# Altium schematic sheet DMX_RP2040.SchDoc: DMX / RP2040
size B; SheetNumber: 8; SheetTotal: 14
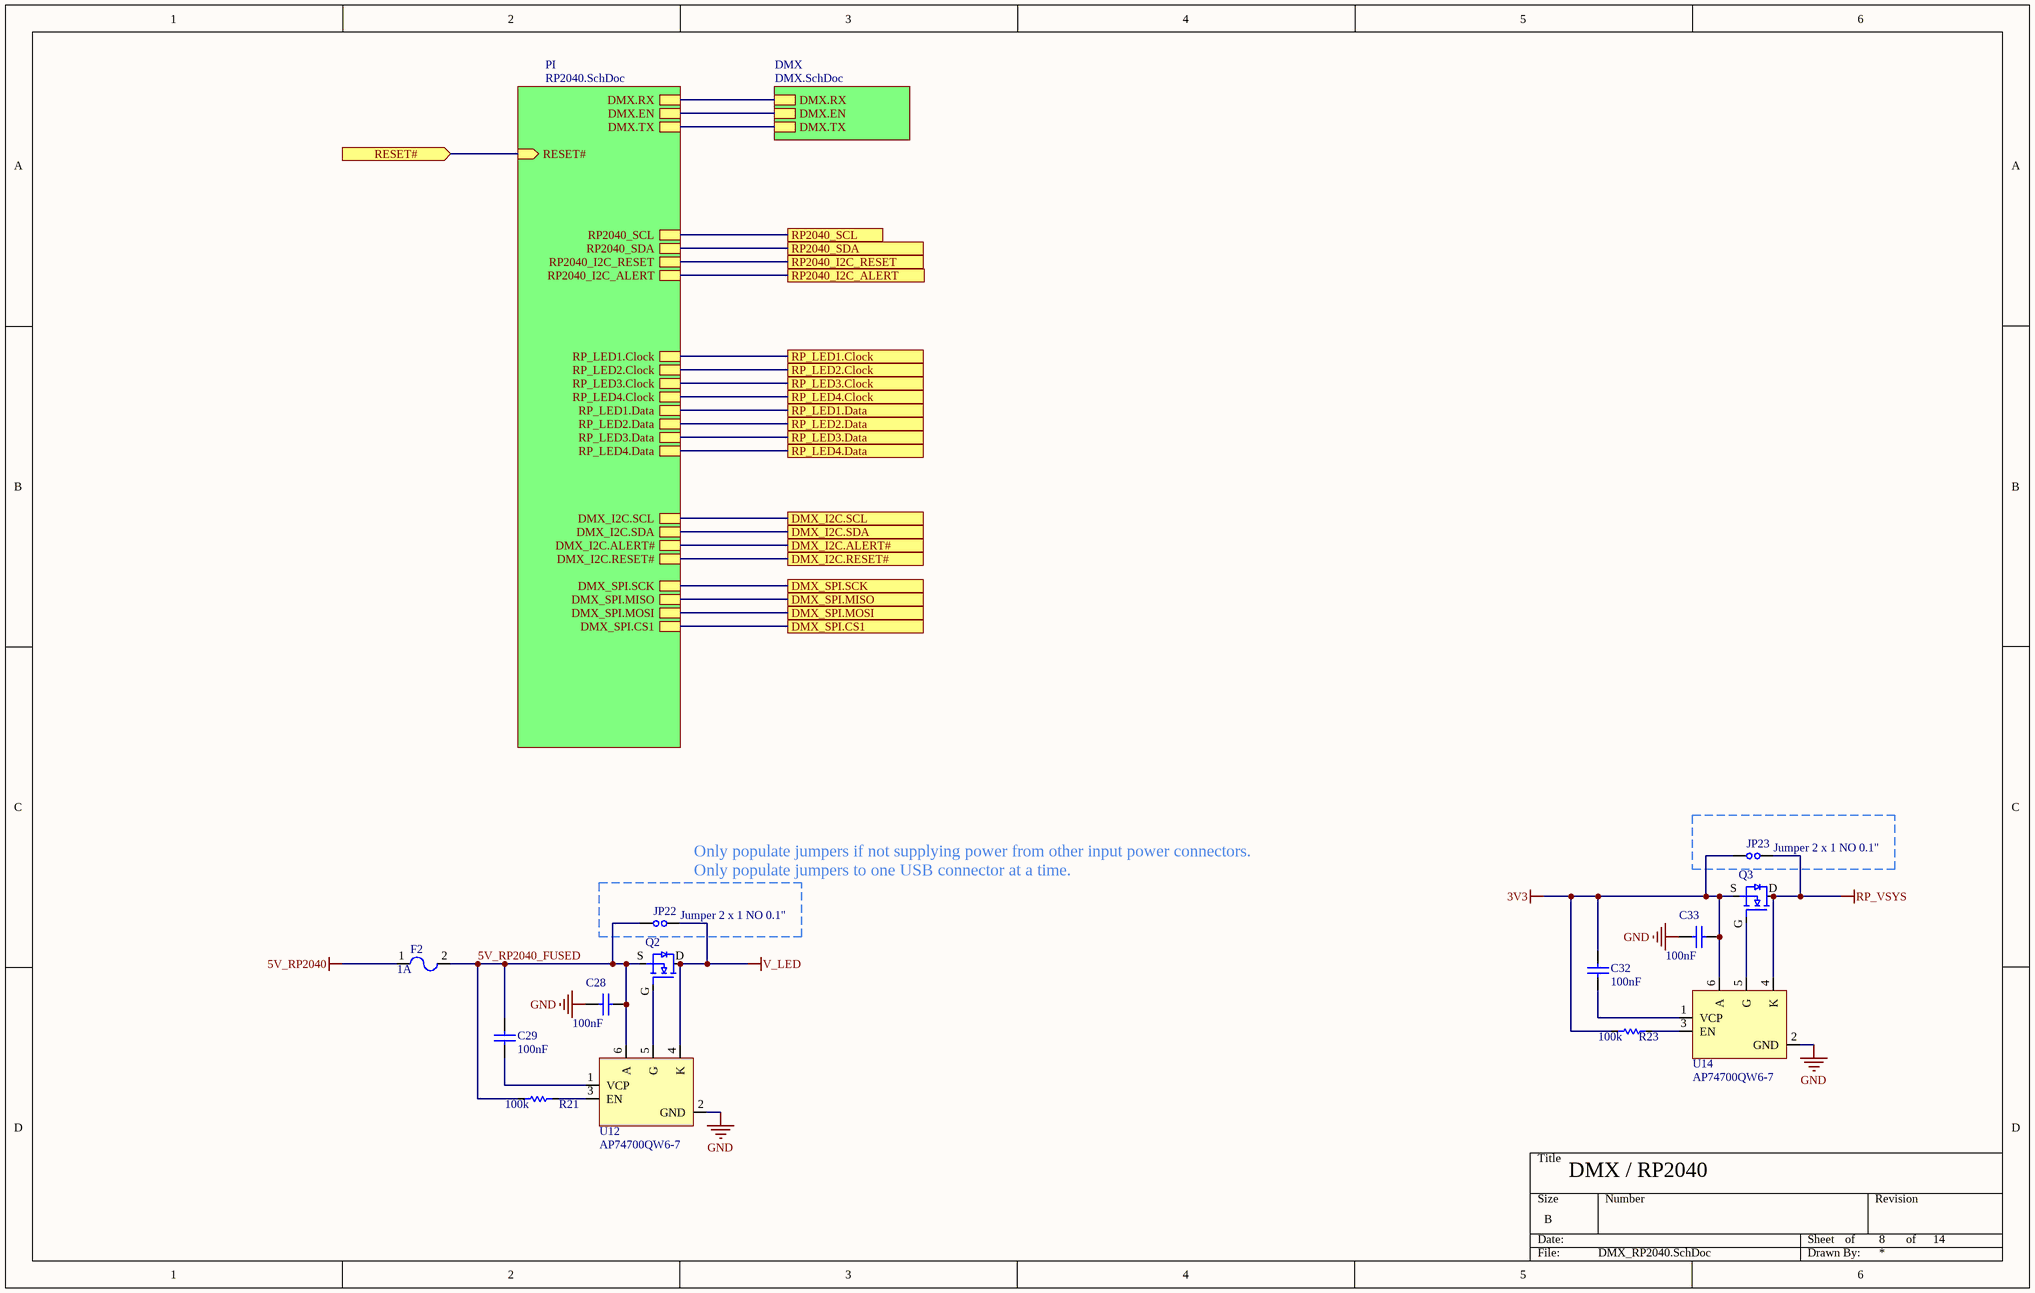
[diagram p0: DMX_RP2040.SchDoc]

## Parts
C28  value 100nF  [CAPC1608X10N_0603_MED]  (hidden comment: CC0603KRX7R0BB104)
C29  value 100nF  [CAPC1608X10N_0603_MED]  (hidden comment: CC0603KRX7R0BB104)
C32  value 100nF  [CAPC1608X10N_0603_MED]  (hidden comment: CC0603KRX7R0BB104)
C33  value 100nF  [CAPC1608X10N_0603_MED]  (hidden comment: CC0603KRX7R0BB104)
F2  Current Rating: 1A  [FUSE3216X04N_1206MED]  (hidden comment: 0ZCJ0100FF2E)
JP22  Jumper 2 x 1 NO 0.1"  [FP-M20-9990245-MFG]
JP23  Jumper 2 x 1 NO 0.1"  [FP-M20-9990245-MFG]
Q2  DMN6075S-7  [FP-SOT23-MFG]  (value not drawn)
Q3  DMN6075S-7  [FP-SOT23-MFG]  (value not drawn)
R21  value 100k  [RESC1608X06N_0603_MED]  (hidden comment: RC0603DR-07100KL)
R23  value 100k  [RESC1608X06N_0603_MED]  (hidden comment: RC0603DR-07100KL)
U12  AP74700QW6-7  [SOT95P285X130-6N]
U14  AP74700QW6-7  [SOT95P285X130-6N]

## Sub-sheets
DMX = DMX.SchDoc: DMX.RX, DMX.EN, DMX.TX
PI = RP2040.SchDoc: RESET# (in), RP2040_SCL, RP2040_SDA, RP2040_I2C_RESET, RP_LED1.Clock, RP_LED2.Clock, RP_LED3.Clock, RP_LED4.Clock, RP_LED1.Data, RP_LED2.Data, RP_LED3.Data, RP_LED4.Data, RP2040_I2C_ALERT, DMX.RX, DMX.EN, DMX.TX, DMX_I2C.SCL, DMX_I2C.SDA, DMX_I2C.ALERT#, DMX_I2C.RESET#, DMX_SPI.CS1, DMX_SPI.SCK, DMX_SPI.MISO, DMX_SPI.MOSI

## Ports
DMX_I2C.ALERT#, DMX_I2C.RESET#, DMX_I2C.SCL, DMX_I2C.SDA, DMX_SPI.CS1, DMX_SPI.MISO, DMX_SPI.MOSI, DMX_SPI.SCK, RESET# (in), RP2040_I2C_ALERT, RP2040_I2C_RESET, RP2040_SCL, RP2040_SDA, RP_LED1.Clock, RP_LED1.Data, RP_LED2.Clock, RP_LED2.Data, RP_LED3.Clock, RP_LED3.Data, RP_LED4.Clock, RP_LED4.Data

## Nets
3V3: C32.2 C33.1 JP23.1 Q3.S R23.2 U14.6(A)
5V_RP2040: F2.1
GND: C28.2 C33.2 U12.2(GND) U14.2(GND)
RP_VSYS: JP23.2 Q3.D U14.4(K)
V_LED: JP22.2 Q2.D U12.4(K)
5V_RP2040_FUSED: C28.1 C29.2 F2.2 JP22.1 Q2.S R21.1 U12.6(A)
DMX_I2C.ALERT#: port DMX_I2C.ALERT#, sheet PI/DMX_I2C.ALERT#
DMX_I2C.RESET#: port DMX_I2C.RESET#, sheet PI/DMX_I2C.RESET#
DMX_I2C.SCL: port DMX_I2C.SCL, sheet PI/DMX_I2C.SCL
DMX_I2C.SDA: port DMX_I2C.SDA, sheet PI/DMX_I2C.SDA
DMX_SPI.CS1: port DMX_SPI.CS1, sheet PI/DMX_SPI.CS1
DMX_SPI.MISO: port DMX_SPI.MISO, sheet PI/DMX_SPI.MISO
DMX_SPI.MOSI: port DMX_SPI.MOSI, sheet PI/DMX_SPI.MOSI
DMX_SPI.SCK: port DMX_SPI.SCK, sheet PI/DMX_SPI.SCK
RESET#: port RESET#, sheet PI/RESET#
RP2040_I2C_ALERT: port RP2040_I2C_ALERT, sheet PI/RP2040_I2C_ALERT
RP2040_I2C_RESET: port RP2040_I2C_RESET, sheet PI/RP2040_I2C_RESET
RP2040_SCL: port RP2040_SCL, sheet PI/RP2040_SCL
RP2040_SDA: port RP2040_SDA, sheet PI/RP2040_SDA
RP_LED1.Clock: port RP_LED1.Clock, sheet PI/RP_LED1.Clock
RP_LED1.Data: port RP_LED1.Data, sheet PI/RP_LED1.Data
RP_LED2.Clock: port RP_LED2.Clock, sheet PI/RP_LED2.Clock
RP_LED2.Data: port RP_LED2.Data, sheet PI/RP_LED2.Data
RP_LED3.Clock: port RP_LED3.Clock, sheet PI/RP_LED3.Clock
RP_LED3.Data: port RP_LED3.Data, sheet PI/RP_LED3.Data
RP_LED4.Clock: port RP_LED4.Clock, sheet PI/RP_LED4.Clock
RP_LED4.Data: port RP_LED4.Data, sheet PI/RP_LED4.Data
NetC29_1: C29.1 U12.1(VCP)
NetC32_1: C32.1 U14.1(VCP)
NetQ2_G: Q2.G U12.5(G)
NetQ3_G: Q3.G U14.5(G)
NetR21_2: R21.2 U12.3(EN)
NetR23_1: R23.1 U14.3(EN)
(unnamed): sheet DMX/DMX.RX, sheet PI/DMX.RX
(unnamed): sheet DMX/DMX.EN, sheet PI/DMX.EN
(unnamed): sheet DMX/DMX.TX, sheet PI/DMX.TX

## Notes on the sheet
- (near JP22) Only populate jumpers if not supplying power from other input power connectors.
  Only populate jumpers to one USB connector at a time.
- of

## Library data of the parts
C28 C29 C32 C33 = CMP-001-00102-4: Ceramic Capacitor, Multilayer, Ceramic, 100V, 10% +Tol, 10% -Tol, X7R, 15% TC, 0.1uF, Surface Mount, 0603; Max Operating Temperature: 125°C; RoHS Compliant: Yes; Case/Package: 0603; Mounting Technology: Surface Mount; Capacitor Type: Ceramic; Pins: 2; Voltage Rating: 100V; Min Operating Temperature: -55°C; JLCPN: C113803
F2 = CMP-005-00017-1: PTC Resettable Fuse, 6V, 0.055ohm, Surface Mount; Max Operating Temperature: 85°C; Case/Package: 1206; Pins: 2; Min Operating Temperature: -40°C; RoHS Compliant: Yes
JP22 JP23 = CMP-002-00086-5: Connector Type: BOARD CONNECTOR; Pins: 2; Max Operating Temperature: 105°C; RoHS Compliant: Yes; Mounting Technology: Through Hole; Min Operating Temperature: -40°C
Q2 Q3 = CMP-013-00052-1: Single N-Channel 60 V 120 mOhm 12.3 nC 0.8 W Silicon Mosfet - SOT-23; Vgs (Max): 20V; Power: 800mW; Vgs(th) (Max) @ Id: 3; Max Operating Temperature: 150°C; Case/Package: TO-236-3; Mounting Technology: Surface Mount; Min Operating Temperature: -55°C
R21 R23 = CMP-009-00328-2: Fixed Resistor, Metal Glaze/thick Film, 0.1W, 100000ohm, 75V, 0.5% +/-Tol, 100ppm/Cel, Surface Mount, 0603; Power: 100mW; Voltage Rating: 50V; RoHS Compliant: Yes; Max Operating Temperature: 155°C; JLCPN: C163504; Case/Package: 0603; Min Operating Temperature: -55°C; Pins: 2; Mounting Technology: Surface Mount; Tolerance: 0.5%
U12 U14 = CMP-004-00052-1: ORController N-Channel Single Automotive AEC-Q100 6-Pin SOT-26 T/R; Min Operating Temperature: -40°C; Max Operating Temperature: 125°C